# EAGLE design grbl-board (EAGLE 7.5.0)
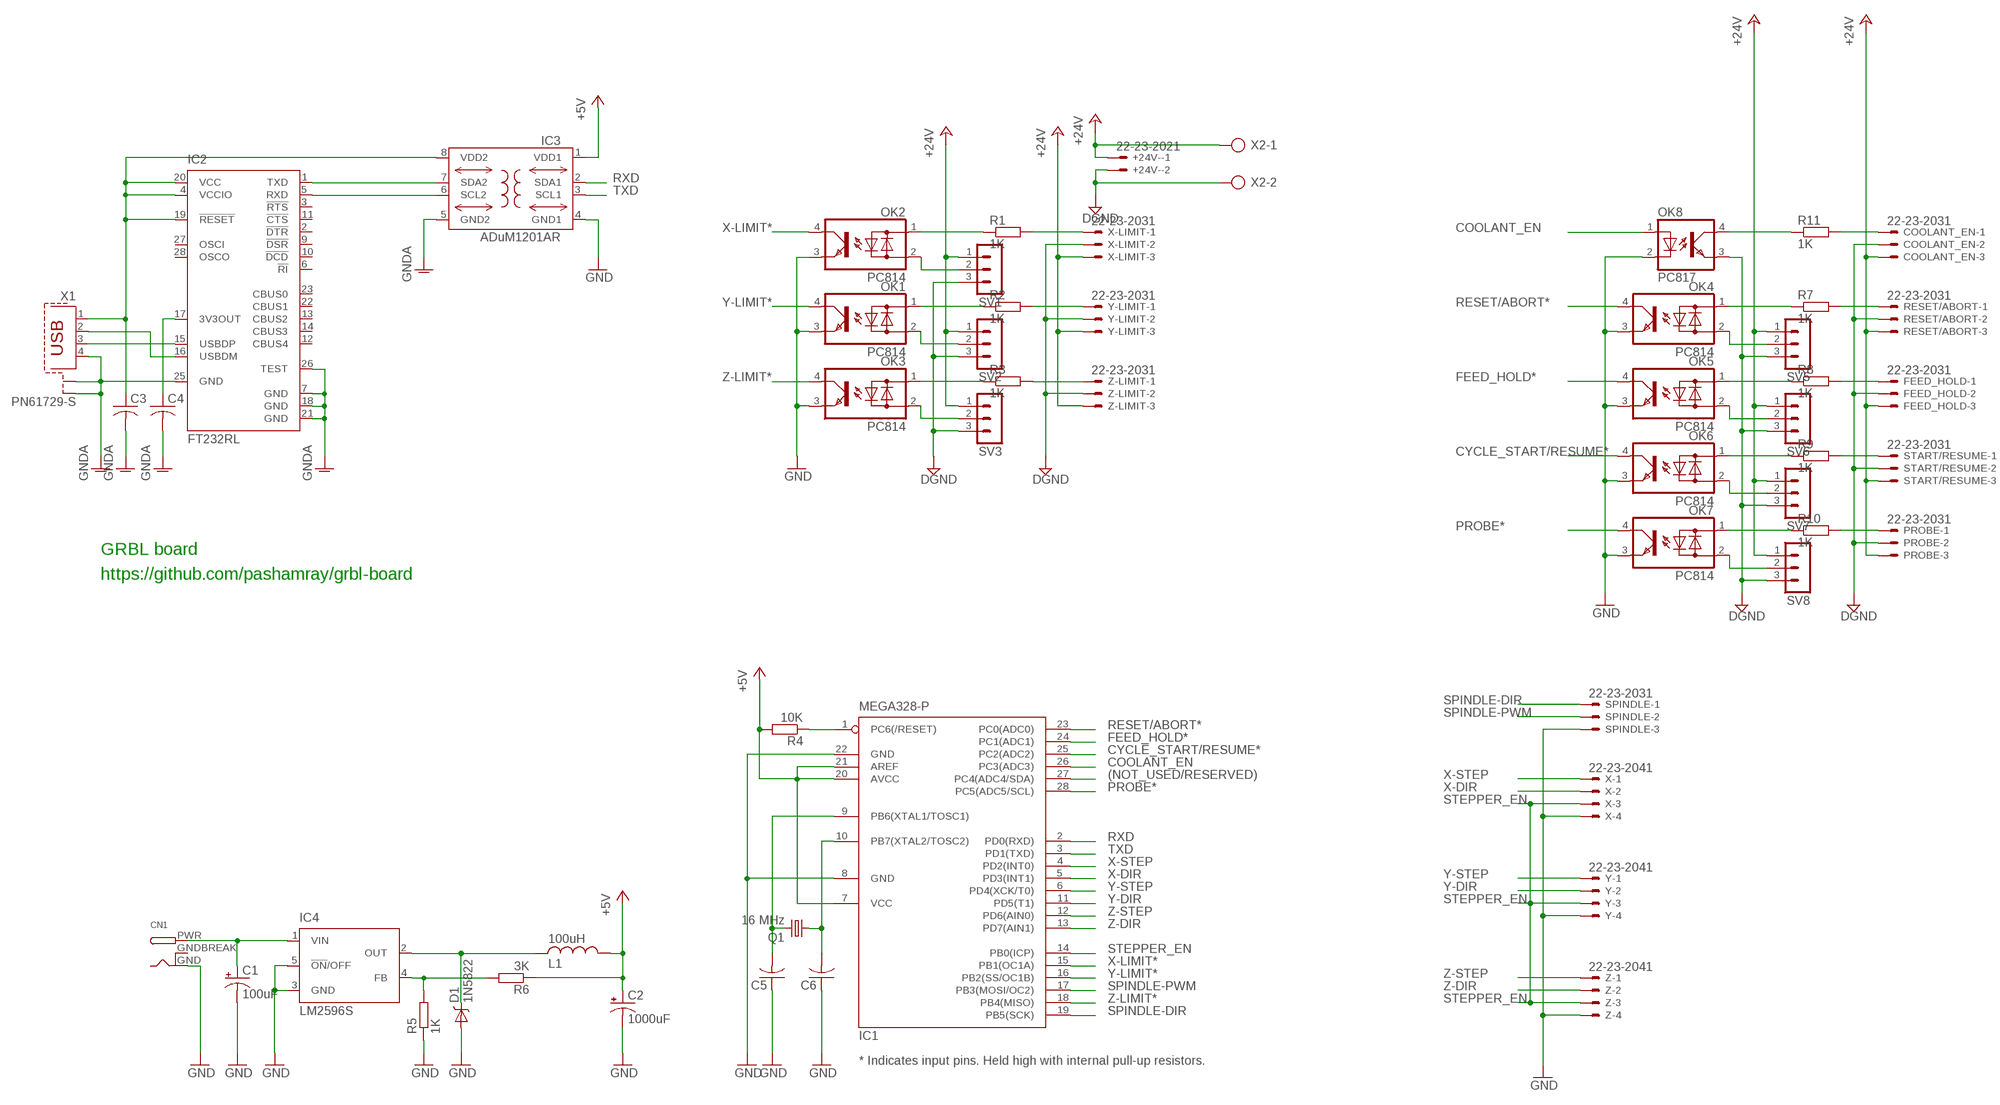
[diagram p0: schematic, sheet 1]

## Parts
+24V-  22-23-2021  [22-23-2021]
C1  100uF  CPOL-USE5-6  [E5-6]
C2  1000uF  CPOL-USE5-10.5  [E5-10,5]
C3  C-USC0805K  [C0805K]
C4  C-USC0805K  [C0805K]
C5  C-USC0805K  [C0805K]
C6  C-USC0805K  [C0805K]
CN1  DCBARRELPTH  [DCJACK_2MM_PTH]
COOLANT_EN  22-23-2031  [22-23-2031]
D1  1N5822  DIODE-SCHOTTKY_  [SMA-DIODE]
FEED_HOLD  22-23-2031  [22-23-2031]
IC1  MEGA328-P  MEGA8-P  [DIL28-3]
IC2  FT232RL  [SSOP28]
IC3  ADuM1201AR  ADUM1250  [SO8-COOL]
IC4  LM2596S  [TO263-5]
L1  100uH  L1800R  [1800R]
OK1  PC814  [DIL04]
OK2  PC814  [DIL04]
OK3  PC814  [DIL04]
OK4  PC814  [DIL04]
OK5  PC814  [DIL04]
OK6  PC814  [DIL04]
OK7  PC814  [DIL04]
OK8  PC817  [DIL04]
PROBE  22-23-2031  [22-23-2031]
Q1  16 MHz  CRYSTALHC49S  [HC49/S]
R1  1K  R-EU_M0805  [M0805]
R2  1K  R-EU_M0805  [M0805]
R3  1K  R-EU_M0805  [M0805]
R4  10K  R-EU_M0805  [M0805]
R5  1K  R-EU_M0805  [M0805]
R6  3K  R-EU_M0805  [M0805]
R7  1K  R-EU_M0805  [M0805]
R8  1K  R-EU_M0805  [M0805]
R9  1K  R-EU_M0805  [M0805]
R10  1K  R-EU_M0805  [M0805]
R11  1K  R-EU_M0805  [M0805]
RESET/ABORT  22-23-2031  [22-23-2031]
SPINDLE  22-23-2031  [22-23-2031]
START/RESUME  22-23-2031  [22-23-2031]
SV1  MA03-1  [MA03-1]
SV2  MA03-1  [MA03-1]
SV3  MA03-1  [MA03-1]
SV5  MA03-1  [MA03-1]
SV6  MA03-1  [MA03-1]
SV7  MA03-1  [MA03-1]
SV8  MA03-1  [MA03-1]
X  22-23-2041  [22-23-2041]
X1  PN61729-S  [PN61729-S]
X2  AK500/2  [AK500/2]
X-LIMIT  22-23-2031  [22-23-2031]
Y  22-23-2041  [22-23-2041]
Y-LIMIT  22-23-2031  [22-23-2031]
Z  22-23-2041  [22-23-2041]
Z-LIMIT  22-23-2031  [22-23-2031]

## Nets
(NOT_USED/RESERVED): IC1.27(PC4(ADC4/SDA))
+5V: C2.+ IC1.7(VCC) IC1.20(AVCC) IC1.21(AREF) IC3.1(VDD1) L1.1 R4.2 R6.1
+24V: +24V-.1 COOLANT_EN.3 FEED_HOLD.3 PROBE.3 RESET/ABORT.3 START/RESUME.3 SV1.1 SV2.1 SV3.1 SV5.1 SV6.1 SV7.1 SV8.1 X2.1 X-LIMIT.3 Y-LIMIT.3 Z-LIMIT.3
COOLANT_EN: IC1.26(PC3(ADC3)) OK8.1(A)
CYCLE_START/RESUME*: IC1.25(PC2(ADC2)) OK6.4(C)
DGND: +24V-.2 COOLANT_EN.2 FEED_HOLD.2 OK8.3(EMIT) PROBE.2 RESET/ABORT.2 START/RESUME.2 SV1.3 SV2.3 SV3.3 SV5.3 SV6.3 SV7.3 SV8.3 X2.2 X-LIMIT.2 Y-LIMIT.2 Z-LIMIT.2
FEED_HOLD*: IC1.24(PC1(ADC1)) OK5.4(C)
GND: C1.- C2.- C5.1 C6.1 CN1.GND D1.A IC1.8(GND) IC1.22(GND) IC3.4(GND1) IC4.3(GND) IC4.5(!ON!/OFF) OK1.3(E) OK2.3(E) OK3.3(E) OK4.3(E) OK5.3(E) OK6.3(E) OK7.3(E) OK8.2(C) R5.1 SPINDLE.3 X.4 Y.4 Z.4
GNDA: C3.2 C4.2 IC2.7(GND) IC2.18(GND) IC2.21(GND) IC2.25(GND) IC2.26(TEST) IC3.5(GND2) X1.4 X1.S1 X1.S2
N$1: IC2.1(TXD) IC3.7(SDA2)
N$2: IC2.5(RXD) IC3.6(SCL2)
N$3: IC2.16(USBDM) X1.2
N$4: IC2.15(USBDP) X1.3
N$5: OK2.1(AC1) R1.1
N$6: C5.2 IC1.9(PB6(XTAL1/TOSC1)) Q1.2
N$7: C6.2 IC1.10(PB7(XTAL2/TOSC2)) Q1.1
N$8: R2.2 Y-LIMIT.1
N$9: R3.2 Z-LIMIT.1
N$10: OK3.1(AC1) R3.1
N$11: OK3.2(AC2) SV3.2
N$12: OK2.2(AC2) SV1.2
N$13: R1.2 X-LIMIT.1
N$14: OK1.2(AC2) SV2.2
N$15: OK1.1(AC1) R2.1
N$16: D1.C IC4.2(OUT) L1.2
N$17: OK4.2(AC2) SV5.2
N$18: IC4.4(FB) R5.2 R6.2
N$19: C1.+ CN1.PWR IC4.1(VIN)
N$20: OK4.1(AC1) R7.1
N$21: OK5.2(AC2) SV6.2
N$22: OK6.2(AC2) SV7.2
N$23: OK7.2(AC2) SV8.2
N$24: OK5.1(AC1) R8.1
N$25: OK6.1(AC1) R9.1
N$26: OK7.1(AC1) R10.1
N$27: PROBE.1 R10.2
N$28: R9.2 START/RESUME.1
N$29: FEED_HOLD.1 R8.2
N$30: R7.2 RESET/ABORT.1
N$31: C4.1 IC2.17(3V3OUT)
N$32: OK8.4(COL) R11.1
N$33: COOLANT_EN.1 R11.2
PROBE*: IC1.28(PC5(ADC5/SCL)) OK7.4(C)
RESET: IC1.1(PC6(/RESET)) R4.1
RESET/ABORT*: IC1.23(PC0(ADC0)) OK4.4(C)
RXD: IC1.2(PD0(RXD)) IC3.2(SDA1)
SPINDLE-DIR: IC1.19(PB5(SCK)) SPINDLE.1
SPINDLE-PWM: IC1.17(PB3(MOSI/OC2)) SPINDLE.2
STEPPER_EN: IC1.14(PB0(ICP)) X.3 Y.3 Z.3
TXD: IC1.3(PD1(TXD)) IC3.3(SCL1)
VDD2: C3.1 IC2.4(VCCIO) IC2.19(!RESET) IC2.20(VCC) IC3.8(VDD2) X1.1
X-DIR: IC1.5(PD3(INT1)) X.2
X-LIMIT*: IC1.15(PB1(OC1A)) OK2.4(C)
X-STEP: IC1.4(PD2(INT0)) X.1
Y-DIR: IC1.11(PD5(T1)) Y.2
Y-LIMIT*: IC1.16(PB2(SS/OC1B)) OK1.4(C)
Y-STEP: IC1.6(PD4(XCK/T0)) Y.1
Z-DIR: IC1.13(PD7(AIN1)) Z.2
Z-LIMIT*: IC1.18(PB4(MISO)) OK3.4(C)
Z-STEP: IC1.12(PD6(AIN0)) Z.1
Unconnected: IC2.2(!DTR) IC2.3(!RTS) IC2.6(!RI) IC2.9(!DSR) IC2.10(!DCD) IC2.11(!CTS) IC2.12(CBUS4) IC2.13(CBUS2) IC2.14(CBUS3) IC2.22(CBUS1) IC2.23(CBUS0) IC2.27(OSCI) IC2.28(OSCO)

## Notes on the sheet
- GRBL board
- https://github.com/pashamray/grbl-board
- * Indicates input pins. Held high with internal pull-up resistors.

## Power pins joined to a net without a drawn wire
GNDBREAK: CN1.GNDBREAK

## Library data of the parts
+24V- = con-molex:22-23-2021: .100" (2.54mm) Center Header - 2 Pin; MF: MOLEX; MPN: 22-23-2021; OC_FARNELL: 1462926; OC_NEWARK: 25C3832
C1 C2 = adafruit:CPOL-US: POLARIZED CAPACITOR, American symbol
C3-C6 = adafruit:C-US: CAPACITOR, American symbol
CN1 = adafruit:DCBARREL: 2.0mm DC Barrel Jack DCJACK_2MM_PTH - Through Hole Jack (4UConnector: 05537)
COOLANT_EN FEED_HOLD PROBE RESET/ABORT SPINDLE START/RESUME X-LIMIT Y-LIMIT Z-LIMIT = con-molex:22-23-2031: .100" (2.54mm) Center Header - 3 Pin; MF: MOLEX; MPN: 22-23-2031; OC_FARNELL: 1462950; OC_NEWARK: 30C0862
D1 = SwK-SparkFun:DIODE-SCHOTTKY
IC1 = atmel:MEGA8-P: MICROCONTROLLER 8 Kbytes FLASH, 1 kbytes SRAM, 512 bytes EEPROM, USART, 4-channel 10 bit ADC, 2-channel 8 bit ADC Pin compatible with Atmega48, ATMega88, ATMega168 Source: avr.lbr; OC_FARNELL: unknown; OC_NEWARK: unknown
IC2 = ftdichip:FT232R: Source: http://www.ftdichip.com/Documents/DataSheets/DS_FT232R_v104.pdf; MPN: FT232RL; OC_FARNELL: 1146032; OC_NEWARK: 91K9918
IC3 = analog-devices-3:ADUM1250: Hot Swappable, Dual I2C Isolators Source: http://www.analog.com/static/imported-files/data_sheets/ADUM1250_1251.pdf
IC4 = national-semiconductor:LM2596: SIMPLE SWITCHER® Power Converter 150 kHz 3A Step-Down Voltage Regulator Source: http://www.national.com/ds/LM/LM2596.pdf; MF: NATIONAL SEMICONDUCTOR; MPN: LM2596S-ADJ/NOPB; OC_FARNELL: 9494367; OC_NEWARK: 41K3842
L1 = adafruit:L
OK1-OK7 = optocoupler:PC814: SHARP OPTO COUPLER; OC_FARNELL: 9707662; OC_NEWARK: unknown
OK8 = optocoupler:PC817: SHARP OPTO COUPLER; MPN: PC817X4J000F; OC_FARNELL: 9707727; OC_NEWARK: 97K7059
Q1 = crystal:CRYSTAL: CRYSTAL; OC_FARNELL: 1667008; OC_NEWARK: unknown
R1-R11 = resistor:R-EU_: RESISTOR, European symbol
SV1-SV3 SV5-SV8 = con-lstb:MA03-1: PIN HEADER; OC_FARNELL: unknown; OC_NEWARK: unknown
X Y Z = con-molex:22-23-2041: .100" (2.54mm) Center Header - 4 Pin; MF: MOLEX; MPN: 22-23-2041; OC_FARNELL: 1462920; OC_NEWARK: 38C0355
X1 = con-berg:PN61729-S: BERG USB connector; OC_FARNELL: unknown; OC_NEWARK: unknown
X2 = con-ptr500:AK500/2: CONNECTOR; OC_FARNELL: unknown; OC_NEWARK: unknown

## Board
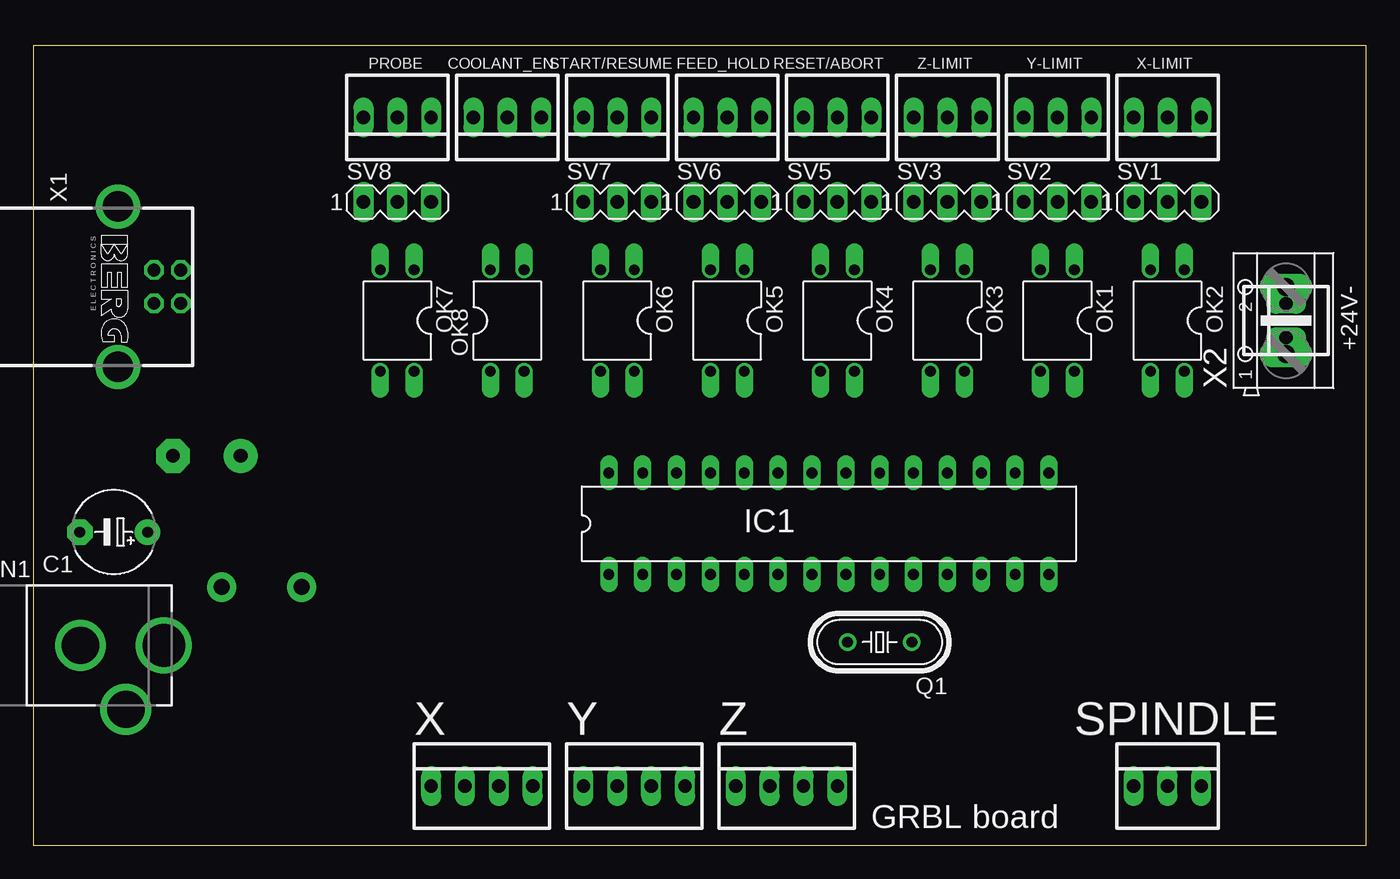
[diagram p1: board, top side]
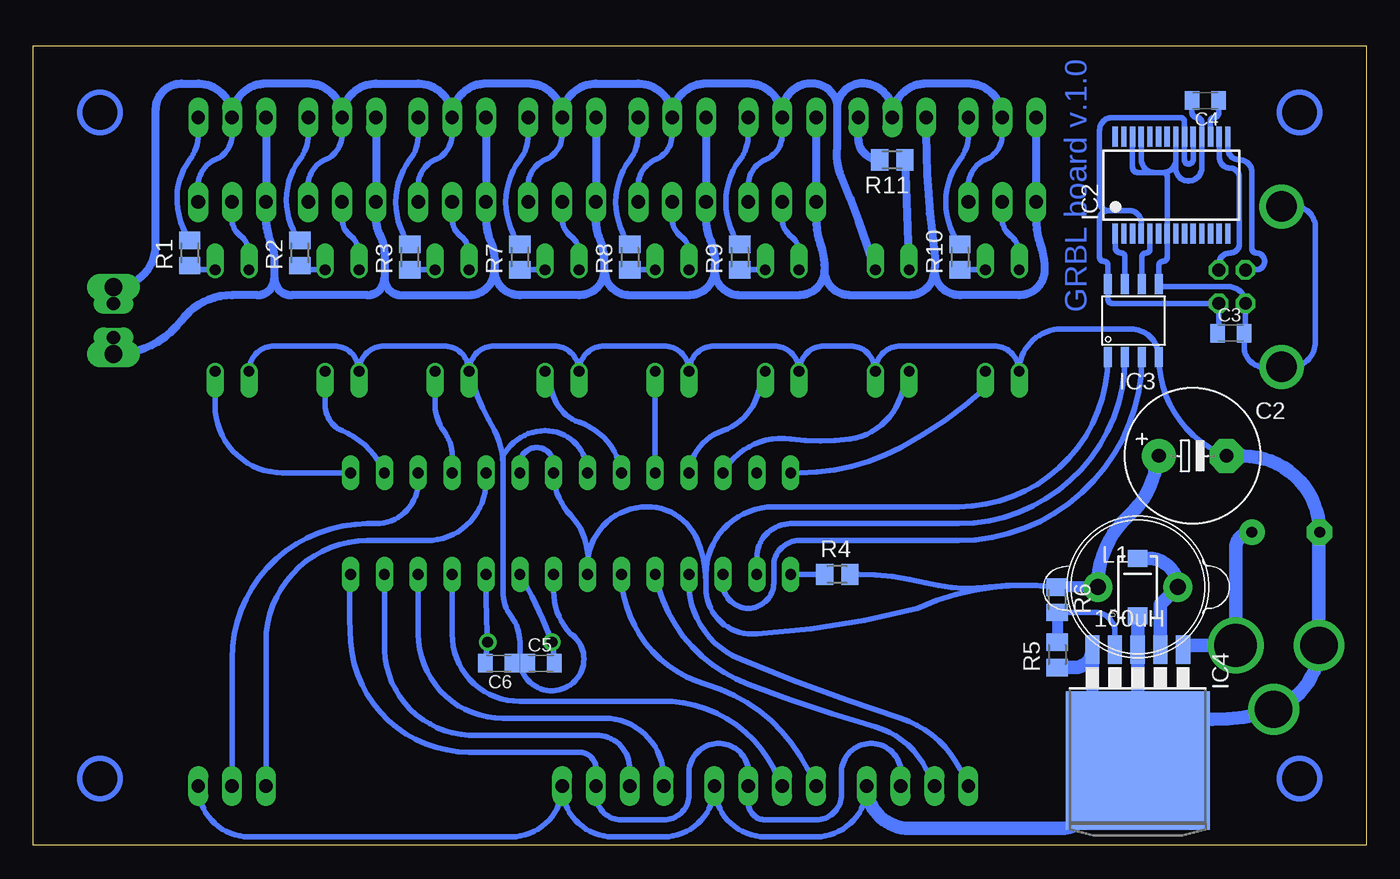
[diagram p2: board, bottom side, seen from below]

Size 100 x 60 mm. Coordinates in mm from the lower left corner, seen from the top.
Outline: 0,0 100,0 100,60 0,60 0,0
Copper layers (1*16): Top 0.035mm / dielectric 1.5mm / Bottom 0.035mm
Design rules "default": minimum track width 10mil, minimum drill 24mil, track to track 8mil, track to pad 8mil, pad to pad 8mil, via to via 8mil, smd to smd 8mil, copper to edge 40mil, drill to drill 8mil, minimum pad ring 10mil, minimum via ring 8mil, stop-mask expansion 4mil, vias tented up to drill 0mil, thermal gap 10mil

### Footprints (pad centres in the part's own frame; a part is rotated, then mirrored left to right if it is on the bottom)
22-23-2021 = drill 1 long: 1 -1.27,0; 2 1.27,0
E5-6 = drill 0.813 pad 1.905: + -2.54,0 | drill 0.813 pad 1.905 octagon: - 2.54,0
E5-10,5 = drill 1.016 pad 2.54: + -2.54,0 | drill 1.016 pad 2.54 octagon: - 2.54,0
C0805K = smd 1.1 x 1.4: 1 -1,0; 2 1,0
DCJACK_2MM_PTH = drill 2.8: GND 0,7.35; GNDBREAK 4.8,10.75 | drill 3.2: PWR 0,13.6
22-23-2031 = drill 1 long: 1 -2.54,0; 2 0,0; 3 2.54,0
SMA-DIODE = smd 1.27 x 1.47: A -2.15,0; C 2.15,0
DIL28-3 = drill 0.813 long: 1 -16.51,-3.81; 2 -13.97,-3.81; 3 -11.43,-3.81; 4 -8.89,-3.81; 5 -6.35,-3.81; 6 -3.81,-3.81; 7 -1.27,-3.81; 8 1.27,-3.81; 9 3.81,-3.81; 10 6.35,-3.81; 11 8.89,-3.81; 12 11.43,-3.81; 13 13.97,-3.81; 14 16.51,-3.81; 15 16.51,3.81; 16 13.97,3.81; 17 11.43,3.81; 18 8.89,3.81; 19 6.35,3.81; 20 3.81,3.81; 21 1.27,3.81; 22 -1.27,3.81; 23 -3.81,3.81; 24 -6.35,3.81; 25 -8.89,3.81; 26 -11.43,3.81; 27 -13.97,3.81; 28 -16.51,3.81
SSOP28 = smd 0.4 x 1.5: 1 -4.225,-3.625; 2 -3.575,-3.625; 3 -2.925,-3.625; 4 -2.275,-3.625; 5 -1.625,-3.625; 6 -0.975,-3.625; 7 -0.325,-3.625; 8 0.325,-3.625; 9 0.975,-3.625; 10 1.625,-3.625; 11 2.275,-3.625; 12 2.925,-3.625; 13 3.575,-3.625; 14 4.225,-3.625; 15 4.225,3.625; 16 3.575,3.625; 17 2.925,3.625; 18 2.275,3.625; 19 1.625,3.625; 20 0.975,3.625; 21 0.325,3.625; 22 -0.325,3.625; 23 -0.975,3.625; 24 -1.625,3.625; 25 -2.275,3.625; 26 -2.925,3.625; 27 -3.575,3.625; 28 -4.225,3.625
SO8-COOL = smd 0.61 x 1.524: 1 -1.905,-2.743; 2 -0.635,-2.743; 3 0.635,-2.743; 4 1.905,-2.743; 5 1.905,2.743; 6 0.635,2.743; 7 -0.635,2.743; 8 -1.905,2.743
TO263-5 = smd 1.067 x 2.159: 1 -3.404,-5.791; 2 -1.702,-5.791; 3 0,-5.791; 4 1.702,-5.791; 5 3.404,-5.791 | smd 10.8 x 10.41: 6 0,2.54
1800R = drill 1.2 pad 2.184: 1 -3,0; 2 3,0
DIL04 = drill 0.813 offset: 1 -1.27,-3.81; 2 1.27,-3.81; 3 1.27,3.81; 4 -1.27,3.81
HC49/S = drill 0.813: 1 -2.413,0; 2 2.413,0
M0805 = smd 1.3 x 1.6: 1 -0.95,0; 2 0.95,0
MA03-1 = drill 1.016 long: 1 -2.54,0; 2 0,0; 3 2.54,0
22-23-2041 = drill 1 long: 1 -3.81,0; 2 -1.27,0; 3 1.27,0; 4 3.81,0
PN61729-S = drill 0.95 octagon: 1 1.25,4.71; 2 -1.25,4.71; 3 -1.25,2.71; 4 1.25,2.71 | drill 2.3 pad 2.9: S1 -6.02,0; S2 6.02,0
AK500/2 = drill 1.321 long: 1 -2.515,0; 2 2.515,0

### Placement (x,y rotation side)
+24V-  93.98,39.37 90 top
C1  6.03,23.5 180 top
C2  13.02,29.21 0 bottom
C3  10.16,38.42 0 bottom
C4  12.06,55.88 180 bottom
C5  61.91,13.65 0 bottom
C6  65.09,13.65 180 bottom
CN1  -3.81,15 270 top
COOLANT_EN  35.56,54.61 180 top
D1  17.14,19.37 90 bottom
FEED_HOLD  52.07,54.61 180 top
IC1  59.69,24.13 0 top
IC2  14.61,49.53 0 bottom
IC3  17.46,39.37 0 bottom
IC4  17.14,8.89 180 bottom
L1  17.14,19.37 0 bottom
OK1  76.83,39.37 180 top
OK2  85.09,39.37 180 top
OK3  68.58,39.37 180 top
OK4  60.33,39.37 180 top
OK5  52.07,39.37 180 top
OK6  43.81,39.37 180 top
OK7  27.3,39.37 180 top
OK8  35.56,39.37 0 top
PROBE  27.3,54.61 180 top
Q1  63.5,15.24 180 top
R1  88.27,44.45 90 bottom
R2  80.01,44.45 90 bottom
R3  71.75,44.13 90 bottom
R4  39.69,20.32 0 bottom
R5  23.18,14.29 90 bottom
R6  23.18,18.41 270 bottom
R7  63.5,44.13 90 bottom
R8  55.24,44.13 90 bottom
R9  46.99,44.13 90 bottom
R10  30.48,44.13 90 bottom
R11  35.56,51.44 180 bottom
RESET/ABORT  60.33,54.61 180 top
SPINDLE  85.09,4.45 0 top
START/RESUME  43.81,54.61 180 top
SV1  85.09,48.26 0 top
SV2  76.83,48.26 0 top
SV3  68.58,48.26 0 top
SV5  60.33,48.26 0 top
SV6  52.07,48.26 0 top
SV7  43.81,48.26 0 top
SV8  27.3,48.26 0 top
X  33.66,4.45 0 top
X1  6.35,41.91 270 top
X2  93.98,39.37 90 top
X-LIMIT  85.09,54.61 180 top
Y  45.09,4.45 0 top
Y-LIMIT  76.83,54.61 180 top
Z  56.52,4.45 0 top
Z-LIMIT  68.58,54.61 180 top

### Tracks (layer width: path | path; a pad name or v marks a point on that pad's centre or on a via)
+5V
  Bottom 0.406: L1.1 | IC1.20 63.5,28.57 arc90 62.23,29.84 arc90 60.96,28.57 IC1.21 arc-44 59.69,24.77 arc50 58.42,20.95 | IC3.1 arc90 30.59,25.4 44.45,25.4 arc-90 49.53,20.32 49.53,19.68 | IC1.7 58.42,20.95 | 58.42,20.95 arc90 53.98,25.4 arc68 50.16,22.86 arc22 49.53,19.68 | 49.53,19.68 arc-102 45.72,15.88 arc-12 33.66,17.78 arc32 R6.1 arc-13 28.26,19.37 arc21 33.02,19.68 arc-14 38.1,20.32 R4.2
  Bottom 0.813: L1.1 R6.1
  Bottom 1.016: C2.+ 15.88,27.94 arc34 17.78,24.77 arc-48 L1.1
+24V
  Bottom 0.406: SV1.1 82.55,46.99
  Bottom 0.61: X-LIMIT.3 SV1.1 | Y-LIMIT.3 SV2.1 74.3,46.99 arc-28 73.98,45.72 arc28 73.66,44.45 73.66,42.55 | Z-LIMIT.3 SV3.1 66.04,46.99 arc-23 65.72,45.4 arc29 65.41,43.18 | 65.41,43.18 arc90 67.31,41.27 72.39,41.27 arc90 73.66,42.55 | +24V-.1 X2.1 arc-54 88.9,39.37 arc53 85.09,41.27 83.19,41.27 arc-90 81.92,42.55 | START/RESUME.3 SV7.1 41.27,46.99 arc-19 40.96,45.09 arc19 40.64,43.18 | 40.64,43.18 arc90 42.55,41.27 46.99,41.27 arc90 48.9,43.18 | 48.9,43.18 arc90 50.8,41.27 55.24,41.27 arc90 57.15,43.18 | 57.15,43.18 arc90 59.05,41.27 63.5,41.27 arc90 65.41,43.18 | PROBE.3 SV8.1 24.77,46.99 arc-19 24.45,45.09 arc19 24.13,43.18 arc90 26.04,41.27 30.48,41.27 arc90 32.38,43.18 | FEED_HOLD.3 SV6.1 49.53,46.99 arc-23 49.21,45.4 arc29 48.9,43.18 | RESET/ABORT.3 SV5.1 57.78,46.99 arc-23 57.47,45.4 arc23 57.15,43.81 57.15,43.18 | 81.92,42.55 arc-90 80.64,41.27 74.93,41.27 arc-90 73.66,42.55 | 82.55,46.99 arc-23 82.23,45.4 arc23 81.92,43.81 81.92,42.55 | 40.64,43.18 arc-90 38.73,41.27 34.29,41.27 arc-90 32.38,43.18 | COOLANT_EN.3 33.02,53.34 arc-8 32.38,44.45 arc16 32.38,43.18
COOLANT_EN
  Bottom 0.406: OK8.1 34.92,33.66 arc64 38.73,30.48 arc16 43.18,30.48 arc-69 IC1.26
CYCLE_START/RESUME*
  Bottom 0.406: OK6.4 45.72,33.66 arc53 48.26,31.11 arc-66 IC1.25
DGND
  Bottom 0.406: SV1.3 87.63,49.53 arc67 86.36,51.44 arc-67 85.09,53.34 X-LIMIT.2 | Y-LIMIT.2 76.83,53.34 arc67 78.11,51.44 arc-67 79.38,49.53 SV2.3 | Z-LIMIT.2 68.58,53.34 arc67 69.85,51.44 arc-67 71.12,49.53 SV3.3 | RESET/ABORT.2 60.33,53.34 arc67 61.59,51.44 arc-67 62.87,49.53 SV5.3 | FEED_HOLD.2 52.07,53.34 arc67 53.34,51.44 arc-67 54.61,49.53 SV6.3 | START/RESUME.2 43.81,53.34 arc67 45.09,51.44 arc-67 46.35,49.53 SV7.3 | PROBE.2 27.3,53.34 arc67 28.57,51.44 arc-67 29.84,49.53 SV8.3
  Bottom 0.61: +24V-.2 X2.2 arc-90 90.81,45.06 90.81,55.24 arc90 88.9,57.15 87.63,57.15 arc90 X-LIMIT.2 arc90 82.55,57.15 79.38,57.15 arc90 Y-LIMIT.2 arc90 74.3,57.15 71.12,57.15 arc90 Z-LIMIT.2 arc90 66.04,57.15 62.87,57.15 arc90 RESET/ABORT.2 arc90 57.78,57.15 54.61,57.15 arc90 FEED_HOLD.2 arc90 49.53,57.15 46.35,57.15 arc90 START/RESUME.2 arc90 41.91,57.15 arc90 39.69,55.56 | PROBE.2 arc-90 29.84,57.15 33.02,57.15 arc-90 COOLANT_EN.2 arc-90 37.47,57.15 arc-90 39.69,55.56 | OK8.3 37.47,45.09 arc-4 39.37,50.16 arc29 39.69,52.39 39.69,55.56
FEED_HOLD*
  Bottom 0.406: OK5.4 IC1.24
GND
  Bottom 0.406: OK3.3 arc90 65.41,37.47 60.96,37.47 arc90 OK4.3 arc90 57.15,37.47 52.7,37.47 arc90 OK5.3 arc90 48.9,37.47 44.45,37.47 arc90 OK6.3 arc90 40.64,37.47 38.73,37.47 arc90 OK8.2 arc90 34.92,37.47 27.94,37.47 arc90 OK7.3 arc90 22.86,38.73 17.67,38.73 arc90 IC3.4 arc-69 C2.- | OK3.3 arc-90 69.22,37.47 73.66,37.47 arc-90 OK1.3 arc-90 77.47,37.47 81.92,37.47 arc-90 OK2.3 | 3.54,23.45 arc90 C1.- | X.4 arc90 41.27,0.64 45.09,0.64 arc90 Y.4 arc90 52.7,0.64 56.52,0.64 arc90 Z.4 arc90 64.14,0.64 83.82,0.64 arc90 SPINDLE.3 | 20.64,3.49 20.64,10.79 | 20.64,10.79 20.64,11.75 arc90 20.55,11.84 | 17.14,10.79 20.64,10.79 | C6.1 63.5,13.65 | IC1.8 60.96,19.05 arc-44 59.69,15.88 arc87 59.05,12.7 arc138 63.5,13.65 | OK3.3 66.67,33.66 arc-7 65.41,31.11 arc28 64.77,28.57 | 63.5,13.65 63.5,13.97 | C5.1 63.5,13.97 | 64.77,28.57 64.77,19.05 arc-37 64.14,17.14 arc37 63.5,15.24 63.5,13.97 | 64.77,28.57 64.77,29.21 arc62 61.59,31.11 arc90 IC1.22
  Bottom 1.016: D1.A IC4.3 17.14,10.79 arc-45 6.99,10.16 arc-71 CN1.GND 3.54,23.45 | R5.1 21.89,13.34 arc-90 IC4.5 20.55,11.84 | C1.- arc-90 9.21,29.21 C2.- 10.79,29.21 | X.4 arc-90 34.29,1.27 22.86,1.27 arc-90 20.64,3.49
GNDA
  Bottom 0.406: 6.34,35.88 X1.S2 | C4.2 13.06,54.98 arc-90 12.7,54.61 arc90 12.33,54.24 IC2.18 12.33,50.85 arc90 13.34,49.85 arc90 14.28,50.79 14.28,51.44 | X1.S2 arc90 6.36,35.88 7.62,35.88 arc90 9.16,37.42 C3.2 arc-90 9.06,38.52 X1.4 arc-90 10.31,41.91 15.35,41.91 IC3.5 15.56,43.5 arc90 15.24,43.81 arc-90 14.93,44.12 IC2.7 14.93,50.17 arc-90 15.24,50.48 | X1.S1 5.38,47.93 arc90 3.81,46.35 3.81,37.78 arc90 5.71,35.88 6.34,35.88 | 6.34,35.88 arc90 X1.S2 | IC2.21 14.28,51.44 | 14.28,51.44 arc90 15.24,50.48 | IC2.25 16.88,51.49 arc-90 15.88,50.48 | 15.88,50.48 15.24,50.48 | IC2.26 17.53,50.87 arc-90 17.14,50.48 15.88,50.48
N$1
  Bottom 0.406: IC3.7 18.1,44.13 arc-90 18.41,44.45 arc90 18.83,44.87 IC2.1
N$2
  Bottom 0.406: IC2.5 16.23,44.73 arc90 16.51,44.45 arc-90 16.83,44.13 IC3.6
N$3
  Bottom 0.406: IC2.16 11.03,51.67 arc-90 10.16,50.8 arc90 9.53,50.16 9.53,45.09 arc90 10.16,44.45 arc-110 X1.2
N$4
  Bottom 0.406: IC2.15 10.38,52.29 arc-90 9.53,51.44 arc90 8.57,50.48 8.57,44.77 arc-90 8.26,44.45 arc90 7.62,43.81 arc90 8.26,43.18 arc-3 X1.3
N$5
  Bottom 0.406: OK2.1 87.94,43.18 R1.1
N$6
  Bottom 0.406: C5.2 60.96,14.61 arc-17 Q1.2 arc-11 IC1.9
N$7
  Bottom 0.406: IC1.10 arc-3 Q1.1 C6.2
N$8
  Bottom 0.406: Y-LIMIT.1 79.38,53.34 arc37 80.01,51.44 arc-74 R2.2
N$9
  Bottom 0.406: Z-LIMIT.1 71.12,53.34 arc37 71.75,51.44 arc-74 R3.2
N$10
  Bottom 0.406: R3.1 OK3.1
N$11
  Bottom 0.406: SV3.2 68.58,46.99 arc-53 67.94,45.72 arc53 67.31,44.45 OK3.2
N$12
  Bottom 0.406: SV1.2 85.09,46.99 arc-53 84.45,45.72 arc53 83.82,44.45 OK2.2
N$13
  Bottom 0.406: X-LIMIT.1 87.63,53.34 arc37 88.27,51.44 arc-40 89.22,48.26 arc-30 R1.2
N$14
  Bottom 0.406: SV2.2 76.83,46.99 arc-53 76.2,45.72 arc53 75.56,44.45 OK1.2
N$15
  Bottom 0.406: OK1.1 79.69,43.18 R2.1
N$16
  Bottom 0.406: IC4.2 15.56,14.68
  Bottom 1.016: D1.C 16.3,21.52 arc90 L1.2 15.44,18.07 IC4.2
N$17
  Bottom 0.406: SV5.2 60.33,46.99 arc-53 59.69,45.72 arc53 59.05,44.45 OK4.2
N$18
  Bottom 0.406: IC4.4 18.85,15.99 arc-90 20.32,17.46 R6.2
  Bottom 0.813: R6.2 R5.2
  Bottom 1.016: R6.2 arc90 R6.2
N$19
  Bottom 0.406: CN1.PWR 9.79,16.86
  Bottom 1.016: IC4.1 13.74,15 CN1.PWR 9.79,22.28 arc90 C1.+
N$20
  Bottom 0.406: OK4.1 R7.1
N$21
  Bottom 0.406: OK5.2 50.8,44.45 arc-53 51.44,45.72 arc53 52.07,46.99 SV6.2
N$22
  Bottom 0.406: SV7.2 43.81,46.99 arc-53 43.18,45.72 arc53 42.55,44.45 OK6.2
N$23
  Bottom 0.406: SV8.2 27.3,46.99 arc-53 26.67,45.72 arc53 26.04,44.45 OK7.2
N$24
  Bottom 0.406: OK5.1 R8.1
N$25
  Bottom 0.406: OK6.1 R9.1
N$26
  Bottom 0.406: OK7.1 R10.1
N$27
  Bottom 0.406: PROBE.1 29.84,53.34 arc37 30.48,51.44 arc-74 R10.2
N$28
  Bottom 0.406: START/RESUME.1 46.35,53.34 arc37 46.99,51.44 arc-74 R9.2
N$29
  Bottom 0.406: FEED_HOLD.1 54.61,53.34 arc37 55.24,51.44 arc-74 R8.2
N$30
  Bottom 0.406: RESET/ABORT.1 62.87,53.34 arc37 63.5,51.44 arc-74 R7.2
N$31
  Bottom 0.406: IC2.17 11.68,54.36 arc90 11.43,54.61 arc-90 11.06,54.98 C4.1
N$32
  Bottom 0.61: R11.1 OK8.4
N$33
  Bottom 0.61: R11.2 arc90 38.1,53.02 COOLANT_EN.1
PROBE*
  Bottom 0.406: IC1.28 42.55,27.94 arc-28 34.92,29.84 arc-14 28.57,34.29 OK7.4
RESET
  Bottom 0.406: IC1.1 R4.1
RESET/ABORT*
  Bottom 0.406: OK4.4 60.96,33.66 arc-53 59.05,31.75 arc64 IC1.23
RXD
  Bottom 0.406: IC1.2 45.72,21.59 arc90 43.18,24.13 30.59,24.13 arc-90 IC3.2
SPINDLE-DIR
  Bottom 0.406: IC1.19 66.04,27.3 arc90 70.48,22.86 74.93,22.86 arc-90 82.55,15.24 SPINDLE.1
SPINDLE-PWM
  Bottom 0.406: IC1.17 71.12,27.3 arc90 74.3,24.13 74.93,24.13 arc-90 85.09,13.97 SPINDLE.2
STEPPER_EN
  Bottom 0.406: IC1.14 arc-8 76.2,15.24 arc-86 67.31,6.99 59.05,6.99 arc90 57.78,5.71 Z.3 57.78,3.81 arc-90 55.88,1.91 52.7,1.91 arc-90 50.8,3.81 50.8,5.08 arc90 48.9,7.62 arc90 46.35,5.71 Y.3 46.35,3.17 arc-90 45.09,1.91 41.27,1.91 arc-90 39.37,3.81 39.37,5.71 arc90 36.83,7.62 arc90 34.92,5.08 X.3
TXD
  Bottom 0.406: IC3.3 arc90 30.59,22.86 42.55,22.86 arc-90 44.45,20.95 44.45,19.68 arc90 46.35,17.78 arc90 48.26,19.68 IC1.3
VDD2
  Bottom 0.406: 19.37,47.62 arc-90 20,46.99 20,44.13 arc-90 19.68,43.81 arc90 19.37,43.5 IC3.8 19.37,40.96 arc-90 19.07,40.66 X1.1 11.06,38.52 arc90 C3.1 | IC2.4 16.88,46.73 arc-90 17.78,47.62 19.37,47.62 | 19.37,47.62 arc90 20,48.26 20,53.66 arc90 19.05,54.61 13.97,54.61 arc90 13.63,54.27 IC2.20 13.63,51.41 arc-90 13.34,51.12 arc-90 12.98,51.47 IC2.19
X-DIR
  Bottom 0.406: X.2 33.02,5.71 arc-47 36.83,8.89 arc5 46.35,12.06 arc58 IC1.5
X-LIMIT*
  Bottom 0.406: OK2.4 86.36,33.02 arc-90 81.28,27.94 IC1.15
X-STEP
  Bottom 0.406: X.1 30.48,5.71 arc-46 34.92,9.53 arc5 46.99,13.97 arc73 IC1.4
Y-DIR
  Bottom 0.406: IC1.11 68.58,15.88 arc-90 63.5,10.79 52.07,10.79 arc59 44.45,5.71 Y.2
Y-LIMIT*
  Bottom 0.406: OK1.4 78.11,33.02 arc-67 76.83,31.11 arc45 IC1.16
Y-STEP
  Bottom 0.406: Y.1 41.91,5.71 arc-47 49.53,12.06 arc73 IC1.6
Z-DIR
  Bottom 0.406: Z.2 55.24,5.71 arc-90 57.78,8.26 67.31,8.26 arc90 73.66,15.24 IC1.13
Z-LIMIT*
  Bottom 0.406: OK3.4 69.85,33.02 arc-37 69.22,31.11 arc37 68.58,29.21 IC1.18
Z-STEP
  Bottom 0.406: Z.1 52.7,5.08 arc-90 57.15,9.53 64.77,9.53 arc90 71.12,15.88 IC1.12
(copper drawn outside any net)
  shapes: Bottom circle x4

### Text on the board
Bottom: GRBL board v.1.0
tNames: GRBL board